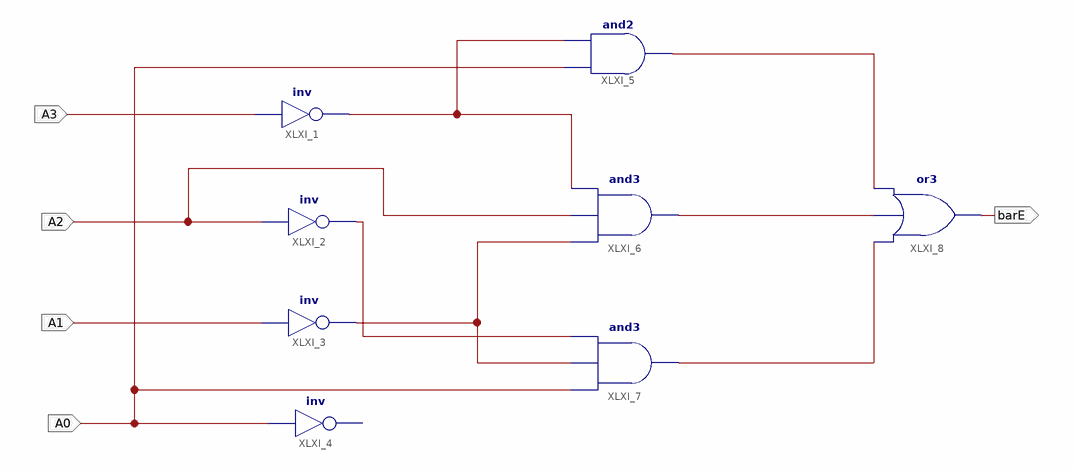
[diagram p0: schematic sheet 1]
// Xilinx ISE schematic fnd5.sch (spartan6) as structural Verilog: 8 symbols, 5 ports
module fnd5 (
  input  A3,
  input  A2,
  input  A1,
  input  A0,
  output barE
);

  wire XLXN_9, XLXN_13, XLXN_14, XLXN_16, XLXN_17, XLXN_18;

  not XLXI_1 (XLXN_9, A3);
  not XLXI_2 (XLXN_14, A2);
  not XLXI_3 (XLXN_13, A1);
  // inv XLXI_4 has open pins: I=A0, O=open
  and XLXI_5 (XLXN_16, A0, XLXN_9);
  and XLXI_6 (XLXN_17, XLXN_13, A2, XLXN_9);
  and XLXI_7 (XLXN_18, A0, XLXN_13, XLXN_14);
  or XLXI_8 (barE, XLXN_18, XLXN_17, XLXN_16);
endmodule
